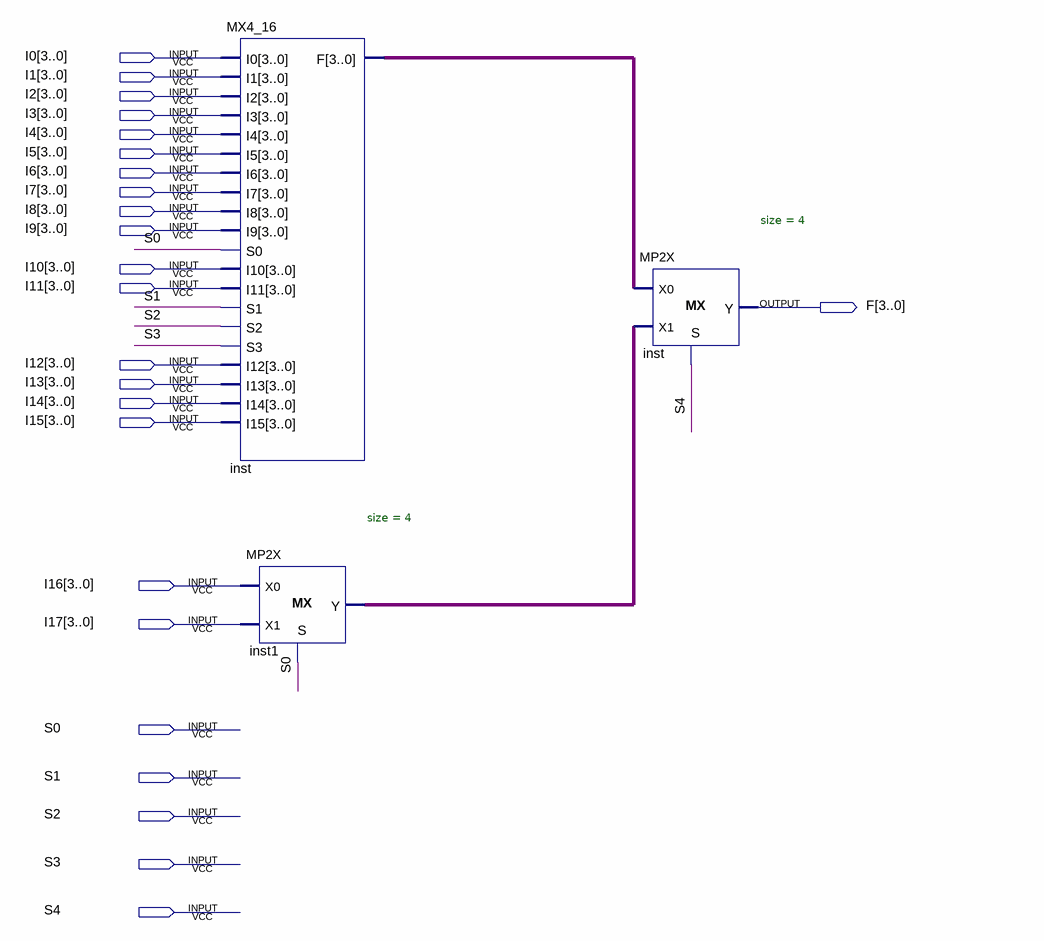
[diagram p0: schematic sheet]
// Quartus schematic MX4_18.bdf as structural Verilog: 3 symbols, 24 pins
module MX4_18 (
  input  [3:0] I0,
  input  [3:0] I1,
  input  [3:0] I2,
  input  [3:0] I3,
  input  [3:0] I4,
  input  [3:0] I5,
  input  [3:0] I6,
  input  [3:0] I7,
  input  [3:0] I8,
  input  [3:0] I9,
  input  [3:0] I10,
  input  [3:0] I11,
  input  [3:0] I12,
  input  [3:0] I13,
  input  [3:0] I14,
  input  [3:0] I15,
  input  [3:0] I16,
  input  [3:0] I17,
  input  S0,
  input  S1,
  input  S2,
  input  S3,
  input  S4,
  output [3:0] F
);

  wire [3:0] inst1_y, inst_f;

  MX4_16 inst (
    .I0(I0), .I1(I1), .I2(I2), .I3(I3), .I4(I4), .I5(I5), .I6(I6), .I7(I7), .I8(I8), .I9(I9), .S0(S0),
    .I10(I10), .I11(I11), .S1(S1), .S2(S2), .S3(S3), .I12(I12), .I13(I13), .I14(I14), .I15(I15), .F(inst_f));
  MP2X #(.size(4)) inst1 (.S(S0), .X0(I16), .X1(I17), .Y(inst1_y));
  MP2X #(.size(4)) inst_dup2 (.S(S4), .X0(inst_f), .X1(inst1_y), .Y(F));
endmodule
